# Altium schematic sheet project_vodorezov_switch1.SchDoc: =title_line_1 + title_line_2
size 840 x 594 mm; SheetNumber: n
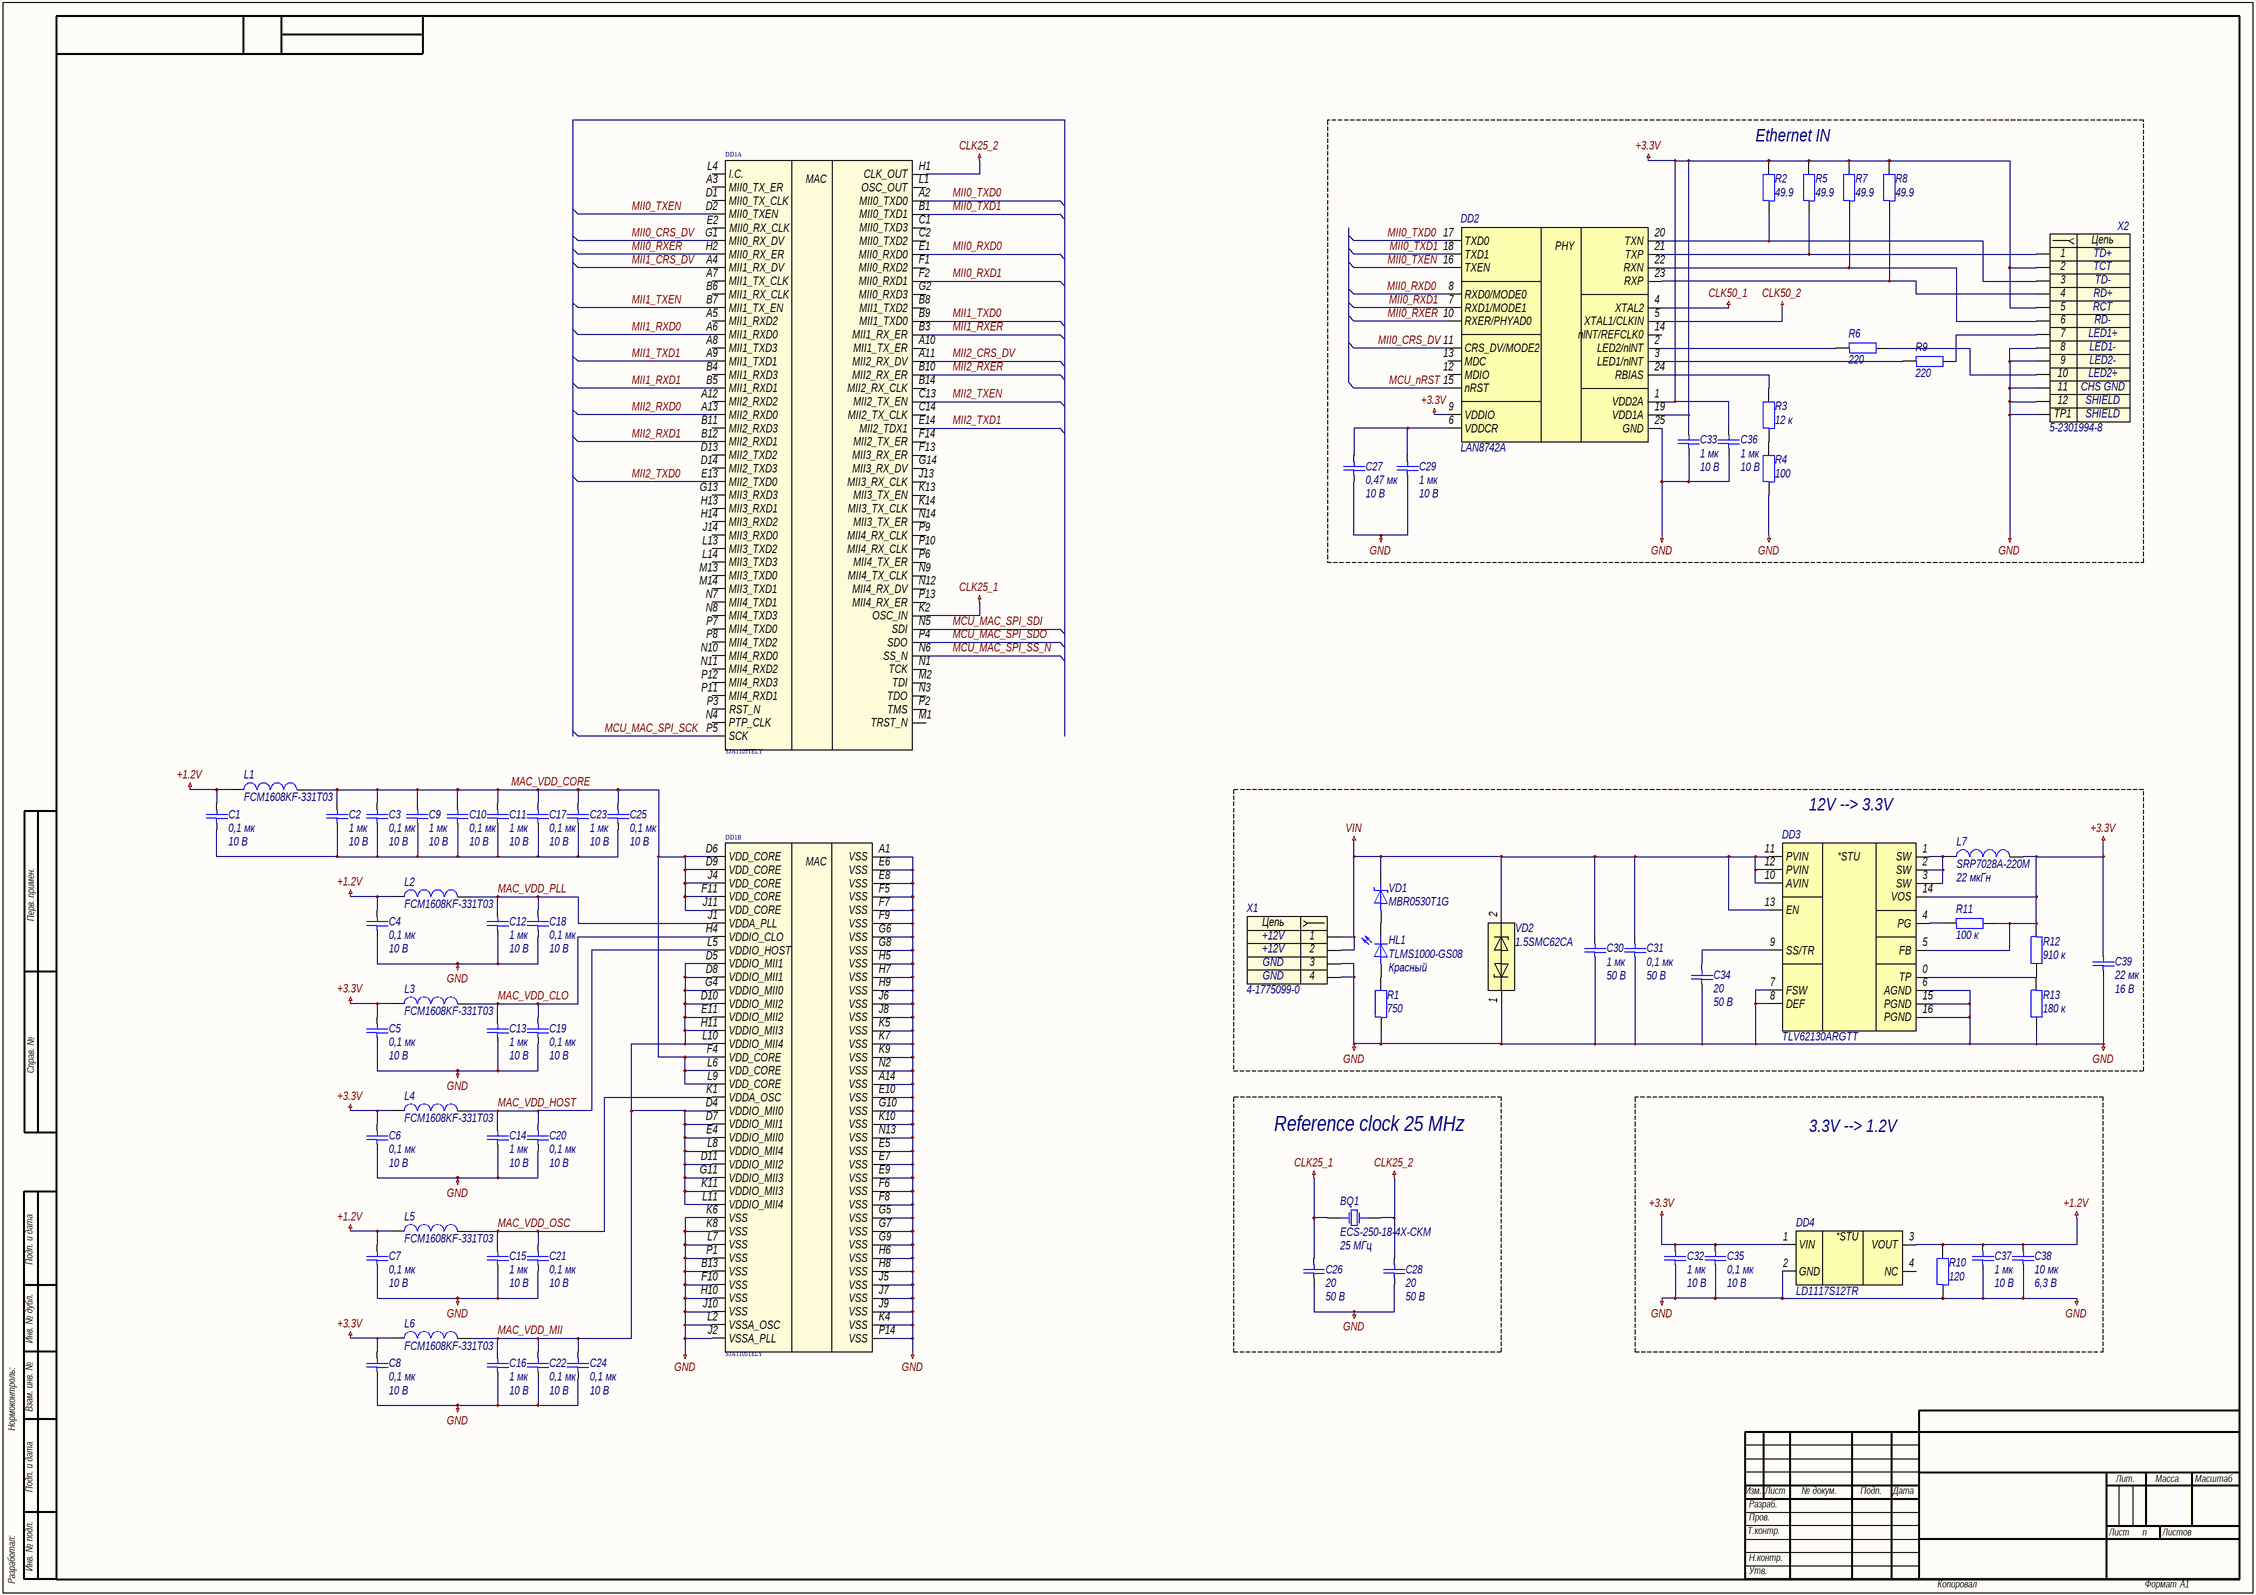
[diagram p0: project_vodorezov_switch1.SchDoc]

## Parts
BQ1  ECS-250-18-4X-СKM  Частотa: 25 МГц  [HC-49/US]
C1  0,1 мк  Напряжение: 10 В  [C0603]
C2  1 мк  Напряжение: 10 В  [C0603]
C3  0,1 мк  Напряжение: 10 В  [C0603]
C4  0,1 мк  Напряжение: 10 В  [C0603]
C5  0,1 мк  Напряжение: 10 В  [C0603]
C6  0,1 мк  Напряжение: 10 В  [C0603]
C7  0,1 мк  Напряжение: 10 В  [C0603]
C8  0,1 мк  Напряжение: 10 В  [C0603]
C9  1 мк  Напряжение: 10 В  [C0603]
C10  0,1 мк  Напряжение: 10 В  [C0603]
C11  1 мк  Напряжение: 10 В  [C0603]
C12  1 мк  Напряжение: 10 В  [C0603]
C13  1 мк  Напряжение: 10 В  [C0603]
C14  1 мк  Напряжение: 10 В  [C0603]
C15  1 мк  Напряжение: 10 В  [C0603]
C16  1 мк  Напряжение: 10 В  [C0603]
C17  0,1 мк  Напряжение: 10 В  [C0603]
C18  0,1 мк  Напряжение: 10 В  [C0603]
C19  0,1 мк  Напряжение: 10 В  [C0603]
C20  0,1 мк  Напряжение: 10 В  [C0603]
C21  0,1 мк  Напряжение: 10 В  [C0603]
C22  0,1 мк  Напряжение: 10 В  [C0603]
C23  1 мк  Напряжение: 10 В  [C0603]
C24  0,1 мк  Напряжение: 10 В  [C0603]
C25  0,1 мк  Напряжение: 10 В  [C0603]
C26  20  Напряжение: 50 В  [C0402]
C27  0,47 мк  Напряжение: 10 В  [C0603]
C28  20  Напряжение: 50 В  [C0402]
C29  1 мк  Напряжение: 10 В  [C0603]
C30  1 мк  Напряжение: 50 В  [C0603]
C31  0,1 мк  Напряжение: 50 В  [C0603]
C32  1 мк  Напряжение: 10 В  [C0603]
C33  1 мк  Напряжение: 10 В  [C0603]
C34  20  Напряжение: 50 В  [C0603]
C35  0,1 мк  Напряжение: 10 В  [C0603]
C36  1 мк  Напряжение: 10 В  [C0603]
C37  1 мк  Напряжение: 10 В  [C0603]
C38  10 мк  Напряжение: 6,3 В  [C0603]
C39  22 мк  Напряжение: 16 В  [C1206]
DD1  SJA1105TELY  [BGA159]  (parts A,B of 2)
DD2  LAN8742A  [QFN-24-P50-400X400X80-L40X25-T270X270]
DD3  TLV62130ARGTT  [WQFN-16-P50-300X300X100-L40X24-T168X168]
DD4  LD1117S12TR  [SOT230P700X180-4N]
HL1  TLMS1000-GS08  Цвет: Красный  [HL0603]
L1  FCM1608KF-331T03  [FCM-2-0603]
L2  FCM1608KF-331T03  [FCM-2-0603]
L3  FCM1608KF-331T03  [FCM-2-0603]
L4  FCM1608KF-331T03  [FCM-2-0603]
L5  FCM1608KF-331T03  [FCM-2-0603]
L6  FCM1608KF-331T03  [FCM-2-0603]
L7  SRP7028A-220M  Индуктивность: 22 мкГн  [SRP-2-730X660X280]
R1  750  [R0603]
R2  49.9  [R0603]
R3  12 к  [R0603]
R4  100  [R0603]
R5  49.9  [R0603]
R6  220  [R0603]
R7  49.9  [R0603]
R8  49.9  [R0603]
R9  220  [R0603]
R10  120  [R0603]
R11  100 к  [R0603]
R12  910 к  [R0603]
R13  180 к  [R0603]
VD1  MBR0530T1G  [SOD-123-368X160X135]
VD2  1.5SMC62CA  [DO-214AB-790X590X262]
X1  4-1775099-0  [4-1775099-0]
X2  5-2301994-8  [5-2301994-8]

## Blocks framed on the sheet
Ethernet IN: C27 C29 C33 C36 DD2 R2-R9 X2
12V --> 3.3V: C30 C31 C34 C39 DD3 HL1 L7 R1 R11-R13 VD1 VD2 X1
Reference clock 25 MHz: BQ1 C26 C28
3.3V --> 1.2V: C32 C35 C37 C38 DD4 R10

## Nets
+1.2V: C1.1 C4.1 C7.1 C37.1 C38.1 DD4.3(VOUT) L1.1 L2.1 L5.1 R10.2
+3.3V: C5.1 C6.1 C8.1 C32.1 C33.1 C35.1 C36.1 C39.1 DD2.1(VDD2A) DD2.9(VDDIO) DD2.19(VDD1A) DD3.5(FB) DD3.14(VOS) DD4.1(VIN) L3.1 L4.1 L6.1 L7.2 R2.2 R5.2 R7.2 R8.2 R11.2 R12.1 X2.2 X2.5
CLK25_1: C26.1 DD1.K2(OSC_IN)
CLK25_2: BQ1.2 C28.1 DD1.H1(CLK_OUT)
CLK50_1: DD2.4(XTAL2)
CLK50_2: DD2.5(XTAL1/CLKIN)
GND: C4.2 C5.2 C6.2 C7.2 C8.2 C12.2 C13.2 C14.2 C15.2 C16.2 C18.2 C19.2 C20.2 C21.2 C22.2 C24.2 C26.2 C27.2 C28.2 C29.2 C30.2 C31.2 C32.2 C33.2 C34.2 C35.2 C36.2 C37.2 C38.2 C39.2 DD1.A1(VSS) DD1.A14(VSS) DD1.B13(VSS) DD1.E5(VSS) DD1.E6(VSS) DD1.E7(VSS) DD1.E8(VSS) DD1.E9(VSS) DD1.E10(VSS) DD1.F5(VSS) DD1.F6(VSS) DD1.F7(VSS) DD1.F8(VSS) DD1.F9(VSS) DD1.F10(VSS) DD1.G5(VSS) DD1.G6(VSS) DD1.G7(VSS) DD1.G8(VSS) DD1.G9(VSS) DD1.G10(VSS) DD1.H5(VSS) DD1.H6(VSS) DD1.H7(VSS) DD1.H8(VSS) DD1.H9(VSS) DD1.H10(VSS) DD1.J2(VSSA_PLL) DD1.J5(VSS) DD1.J6(VSS) DD1.J7(VSS) DD1.J8(VSS) DD1.J9(VSS) DD1.J10(VSS) DD1.K4(VSS) DD1.K5(VSS) DD1.K6(VSS) DD1.K7(VSS) DD1.K8(VSS) DD1.K9(VSS) DD1.K10(VSS) DD1.L2(VSSA_OSC) DD1.L7(VSS) DD1.N2(VSS) DD1.N13(VSS) DD1.P1(VSS) DD1.P14(VSS) DD2.25(GND) DD3.6(AGND) DD3.7(FSW) DD3.8(DEF) DD3.15(PGND) DD3.16(PGND) DD4.2(GND) R1.1 R4.1 R10.1 R13.2 VD2.1 X1.3 X1.4 X2.8 X2.9 X2.11 X2.12 X2.TP1
VIN: C30.1 C31.1 DD3.10(AVIN) DD3.11(PVIN) DD3.12(PVIN) DD3.13(EN) VD1.1 VD2.2 X1.1 X1.2
MAC_VDD_CLO: C13.1 C19.1 DD1.H4(VDDIO_CLO) L3.2
MAC_VDD_CORE: C2.1 C3.1 C9.1 C10.1 C11.1 C17.1 C23.1 C25.1 DD1.D6(VDD_CORE) DD1.D9(VDD_CORE) DD1.F4(VDD_CORE) DD1.F11(VDD_CORE) DD1.J4(VDD_CORE) DD1.J11(VDD_CORE) DD1.L6(VDD_CORE) DD1.L9(VDD_CORE) L1.2
MAC_VDD_HOST: C14.1 C20.1 DD1.L5(VDDIO_HOST) L4.2
MAC_VDD_MII: C16.1 C22.1 C24.1 DD1.D4(VDDIO_MII0) DD1.D5(VDDIO_MII1) DD1.D7(VDDIO_MII1) DD1.D8(VDDIO_MII1) DD1.D10(VDDIO_MII2) DD1.D11(VDDIO_MII2) DD1.E4(VDDIO_MII0) DD1.E11(VDDIO_MII2) DD1.G4(VDDIO_MII0) DD1.G11(VDDIO_MII3) DD1.H11(VDDIO_MII3) DD1.K11(VDDIO_MII3) DD1.L8(VDDIO_MII4) DD1.L10(VDDIO_MII4) DD1.L11(VDDIO_MII4) L6.2
MAC_VDD_OSC: C15.1 C21.1 DD1.K1(VDDA_OSC) L5.2
MAC_VDD_PLL: C12.1 C18.1 DD1.J1(VDDA_PLL) L2.2
MCU_MAC_SPI_SCK: DD1.P5(SCK)
MCU_MAC_SPI_SDI: DD1.N5(SDI)
MCU_MAC_SPI_SDO: DD1.P4(SDO)
MCU_MAC_SPI_SS_N: DD1.N6(SS_N)
MCU_nRST: DD2.15(nRST)
MII0_CRS_DV: DD1.G1(MII0_RX_DV) DD2.11(CRS_DV/MODE2)
MII0_RXD0: DD1.E1(MII0_RXD0) DD2.8(RXD0/MODE0)
MII0_RXD1: DD1.F2(MII0_RXD1) DD2.7(RXD1/MODE1)
MII0_RXER: DD1.H2(MII0_RX_ER) DD2.10(RXER/PHYAD0)
MII0_TXD0: DD1.A2(MII0_TXD0) DD2.17(TXD0)
MII0_TXD1: DD1.B1(MII0_TXD1) DD2.18(TXD1)
MII0_TXEN: DD1.D2(MII0_TXEN) DD2.16(TXEN)
MII1_CRS_DV: DD1.A4(MII1_RX_DV)
MII1_RXD0: DD1.A6(MII1_RXD0)
MII1_RXD1: DD1.B5(MII1_RXD1)
MII1_RXER: DD1.B3(MII1_RX_ER)
MII1_TXD0: DD1.B9(MII1_TXD0)
MII1_TXD1: DD1.A9(MII1_TXD1)
MII1_TXEN: DD1.B7(MII1_TX_EN)
MII2_CRS_DV: DD1.A11(MII2_RX_DV)
MII2_RXD0: DD1.A13(MII2_RXD0)
MII2_RXD1: DD1.B12(MII2_RXD1)
MII2_RXER: DD1.B10(MII2_RX_ER)
MII2_TXD0: DD1.E13(MII2_TXD0)
MII2_TXD1: DD1.E14(MII2_TDX1)
MII2_TXEN: DD1.C13(MII2_TX_EN)
NetC1_2: C1.2 C2.2 C3.2 C9.2 C10.2 C11.2 C17.2 C23.2 C25.2
NetC27_1: C27.1 C29.1 DD2.6(VDDCR)
NetC34_1: C34.1 DD3.9(SS/TR)
NetDD2_2: DD2.2(LED2/nlNT) R6.1
NetDD2_3: DD2.3(LED1/nlNT) R9.1
NetDD2_20: DD2.20(TXN) R2.1 X2.3
NetDD2_21: DD2.21(TXP) R5.1 X2.1
NetDD2_22: DD2.22(RXN) R7.1 X2.6
NetDD2_23: DD2.23(RXP) R8.1 X2.4
NetDD2_24: DD2.24(RBIAS) R3.2
NetDD3_0: DD3.0(TP) R12.2 R13.1
NetDD3_1: DD3.1(SW) DD3.2(SW) DD3.3(SW) L7.1
NetDD3_4: DD3.4(PG) R11.1
NetHL1_1: HL1.1 VD1.2
NetHL1_2: HL1.2 R1.2
NetR3_1: R3.1 R4.2
NetR6_2: R6.2 X2.10
NetR9_2: R9.2 X2.7

Not connected (* = marked no-connect by the designer): BQ1 1; DD1 A3(MII0_TX_ER) A5(MII1_RXD2) A7(MII1_TX_CLK) A8(MII1_TXD3) A10(MII1_TX_ER) A12(MII2_RXD2) B4(MII1_RXD3) B6(MII1_RX_CLK) B8(MII1_TXD2) B11(MII2_RXD3) B14(MII2_RX_CLK) C1(MII0_TXD3) C2(MII0_TXD2) C14(MII2_TX_CLK) D1(MII0_TX_CLK) D13(MII2_TXD2) D14(MII2_TXD3) E2(MII0_RX_CLK) F1(MII0_RXD2) F13(MII3_RX_ER) F14(MII2_TX_ER) G2(MII0_RXD3) G13(MII3_RXD3) G14(MII3_RX_DV) H13(MII3_RXD1) H14(MII3_RXD2) J13(MII3_RX_CLK) J14(MII3_RXD0) K13(MII3_TX_EN) K14(MII3_TX_CLK) L1(OSC_OUT) L4(I.C.) L13(MII3_TXD2) L14(MII3_TXD3) M1(TRST_N) M2(TDI) M13(MII3_TXD0) M14(MII3_TXD1) N1(TCK) N3(TDO) N4(PTP_CLK) N7(MII4_TXD1) N8(MII4_TXD3) N9(MII4_TX_CLK) N10(MII4_RXD0) N11(MII4_RXD2) N12(MII4_RX_DV) N14(MII3_TX_ER) P2(TMS) P3(RST_N) P6(MII4_TX_ER) P7(MII4_TXD0) P8(MII4_TXD2) P9(MII4_RX_CLK) P10(MII4_RX_CLK) P11(MII4_RXD1) P12(MII4_RXD3) P13(MII4_RX_ER); DD2 12(MDIO) 13(MDC) 14(nlNT/REFCLK0); DD4 4(NC)

## Notes on the sheet
- Перв. примен.
- Справ. №
- Подп. и дата
- Инв. № дубл.
- Нормоконтроль:
- Взам. инв. №
- Изм.
- Лист
- № докум.
- Подп.
- Дата
- Лит.
- Масса
- Масштаб
- Т.контр.
- Пров.
- Разраб.
- Листов
- Разработал:
- Инв. № подл.
- Н.контр.
- Утв.
- Копировал
- Формат
- А1
- (in symbol dd0017) *STU
- (in symbol dd0025) *STU
- (in symbol dd0028) PHY
- (in symbol dd0029, part A) MAC
- (in symbol dd0029, part B) MAC
- (in symbol x0006) Цепь
- (in symbol x0015) Цепь

## Library data of the parts
BQ1 = bq0008: =Описание; ID: bq0008; Фамилия: Водорезов; Описание: Кварцевый резонатор 25 МГц нагрузочные конденсаторы 18 пФ; Производитель: ECS, Inc. International; Наименование: ECS-250-18-4X-СKM; Частота: 25 МГц; Корпус: HC-49/US; HelpURL: https://ecsxtal.com/hc-49usx
C1 C3-C8 C10 C17-C22 C24 C25 C35 = c0081: =Описание; ID: c0081; Фамилия: Паньков; Описание: Конденсатор керамический чип 0603 100 нФ 10 В ±10 %; Наименование: CC0603KRX7R6BB104; Производитель: YAGEO Corp.; Отклонение: ±10 %; Рабочие температуры: от –55 °С до +125 °С; Температурный коэффициент емкости: X7R; Корпус: 0603; Номинал: 0,1 мк; Номинальное напряжение: 10 В; HelpURL: https://www.yageo.com/upload/media/product/productsearch/datasheet/mlcc/UPY-GPHC_X7R_6.3V-to-50V_20.pdf
C2 C9 C11-C16 C23 C29 C32 C33 C36 C37 = c0112: =Описание; ID: c0112; Фамилия: Паньков; Описание: Конденсатор керамический чип 0603 1 мкФ 10 В ±10 %; Наименование: CC0603KRX5R6BB105; Производитель: YAGEO Corp.; Отклонение: ±10 %; Рабочие температуры: от –55 °С до +85 °С; Температурный коэффициент емкости: X5R; Корпус: 0603; Номинал: 1 мк; Номинальное напряжение: 10 В; HelpURL: https://www.yageo.com/upload/media/product/productsearch/datasheet/mlcc/UPY-GPHC_X5R_4V-to-50V_26.pdf
C26 C28 = c0020: =Описание; ID: c0020; Фамилия: Ляпцев; Описание: Конденсатор керамический чип 0402 20 пФ 50 В ±5 %; Наименование: CC0402JRNPO9BN200; Производитель: YAGEO Corp.; Отклонение: ±5 %; Рабочие температуры: от –55 °С до +125 °С; Температурный коэффициент емкости: C0G; Корпус: 0402; Номинал: 20; Номинальное напряжение: 50 В; HelpURL: https://www.yageo.com/upload/media/product/productsearch/datasheet/mlcc/UPY-GP_NP0_16V-to-50V_18.pdf
C27 = c0103: =Описание; ID: c0103; Фамилия: Паньков; Описание: Конденсатор керамический чип 0603 470 нФ 10 В ±10 %; Наименование: CC0603KRX7R6BB474; Производитель: YAGEO Corp.; Отклонение: ±10 %; Рабочие температуры: от –55 °С до +125 °С; Температурный коэффициент емкости: X7R; Корпус: 0603; Номинал: 0,47 мк; Номинальное напряжение: 10 В; HelpURL: https://www.yageo.com/upload/media/product/productsearch/datasheet/mlcc/UPY-GPHC_X7R_6.3V-to-50V_20.pdf
C30 = c0118: =Описание; ID: c0118; Фамилия: Самарин; Описание: Конденсатор керамический чип 0603 1 мкФ 50 В ±10 %; Наименование: CC0603KPX5R9BB105; Производитель: YAGEO Corp.; Отклонение: ±10 %; Рабочие температуры: от –55 °С до +85 °С; Температурный коэффициент емкости: X5R; Корпус: 0603; Номинал: 1 мк; Номинальное напряжение: 50 В; HelpURL: https://www.yageo.com/upload/media/product/productsearch/datasheet/mlcc/UPY-GPHC_X5R_4V-to-50V_26.pdf
C31 = c0088: =Описание; ID: c0088; Фамилия: Паньков; Описание: Конденсатор керамический чип 0603 100 нФ 50 В ±10 %; Наименование: CC0603KRX7R9BB104; Производитель: YAGEO Corp.; Отклонение: ±10 %; Рабочие температуры: от –55 °С до +125 °С; Температурный коэффициент емкости: X7R; Корпус: 0603; Номинал: 0,1 мк; Номинальное напряжение: 50 В; HelpURL: https://www.yageo.com/upload/media/product/productsearch/datasheet/mlcc/UPY-GPHC_X7R_6.3V-to-50V_20.pdf
C34 = c0021: =Описание; ID: c0021; Фамилия: Паньков; Описание: Конденсатор керамический чип 0603 20 пФ 50 В ±1 %; Наименование: CC0603FRNPO9BN200; Производитель: YAGEO Corp.; Отклонение: ±1 %; Рабочие температуры: от –55 °С до +125 °С; Температурный коэффициент емкости: C0G; Корпус: 0603; Номинал: 20; Номинальное напряжение: 50 В; HelpURL: https://www.yageo.com/upload/media/product/productsearch/datasheet/mlcc/UPY-GP_NP0_16V-to-50V_18.pdf
C38 = c0143: =Описание; ID: c0143; Фамилия: Ляпцев; Описание: Конденсатор керамический чип 0603 10 мкФ 6,3 В ±20 %; Наименование: CC0603MRX5R5BB106; Производитель: YAGEO Corp.; Отклонение: ±20 %; Рабочие температуры: от –55 °С до +85 °С; Температурный коэффициент емкости: X5R; Корпус: 0603; Номинал: 10 мк; Номинальное напряжение: 6,3 В; HelpURL: https://www.yageo.com/upload/media/product/productsearch/datasheet/mlcc/UPY-GPHC_X5R_4V-to-50V_26.pdf
C39 = c0163: =Описание; ID: c0163; Фамилия: Ларионов; Описание: Конденсатор керамический чип 1206 22 мкФ 16 В ±20 %; Наименование: CC1206MKX7R7BB226; Производитель: YAGEO Corp.; Отклонение: ±20 %; Рабочие температуры: от –55 °С до +125 °С; Температурный коэффициент емкости: X7R; Корпус: 1206; Номинал: 22 мк; Номинальное напряжение: 16 В; HelpURL: https://www.yageo.com/upload/media/product/productsearch/datasheet/mlcc/UPY-GPHC_X7R_6.3V-to-50V_20.pdf
DD1 = dd0029: =Описание; SourceLibrary: Add_to_database_2020-10-19; Vendor: NXP; Built_By: EMA_Matt; ID: dd0029; Фамилия: Водорезов; Описание: Ethernet-switch на 5 выхода; Корпус: LFBGA-159; Datasheet: https://www.nxp.com/docs/en/data-sheet/SJA1105.pdf; Manufacturer_Part_Number: SJA1105TELY; Copyright: Copyright (C) 2018 Accelerated Designs. All rights reserved; RefDes: RefDes; Type: DEV; Наименование: SJA1105; Производитель: NXP; HelpURL: https://www.nxp.com/docs/en/data-sheet/SJA1105.pdf
DD2 = dd0028: =Описание; ID: dd0028; Фамилия: Водорезов; Описание: Ethernet-transiver PHY; Производитель: Microchip; Корпус: QFN-24; Наименование: LAN8742A; HelpURL: http://ww1.microchip.com/downloads/en/DeviceDoc/8742a.pdf
DD3 = dd0017: =Описание; ID: dd0017; Фамилия: Самарин; Описание: Понижающий преобразователь напряжения 3,0…17 В / 0,9…5,25 В и 3,0 А; Производитель: Texas Instruments Inc.; Входное напряжение: от 3,0 В до 17 В; Выходное напряжение: от 0,9 до 5,25 В; Коммутируемый ток: до 3,0 А; Частота переключения: от 1,25 МГц до 2,5 МГц; Рабочие температуры: от –40 °С до +85 °С; Корпус: WQFN-16; Наименование: TLV62130ARGTT; HelpURL: https://www.ti.com/product/TLV62130
DD4 = dd0025: =Описание; ID: dd0025; Фамилия: Водорезов; Описание: Линейный понижающий преобразователь напряжения 1.3-15 В / 1.2 В и 0.8 А; Производитель: STMicroelectronics; Входное напряжение: до 15 В; Выходное напряжение: 1.2 В; Коммутируемый ток: до 0.8 А; Рабочие температуры: от –40 °С до +125 °С; Корпус: SOT-223; Наименование: LD1117S12TR; Частота переключения: -; HelpURL: http://www.farnell.com/datasheets/1776449.pdf
HL1 = hl0001: =Описание; ID: hl0001; Фамилия: Ларионов; Описание: Светодиод чип 0603 красный; Производитель: Vishay Intertechnology, Inc.; Номинальная сила света: 4 мкд; Номинальная длина волны: 628 нм; Номинальный прямой ток: 15 мА; Номинальное падение напряжения: 1,8 В; Рассеиваемая мощность: 40 мВт; Рабочие температуры: от –40 °С до +100 °С; Корпус: 0603; Наименование: TLMS1000-GS08; HelpURL: https://www.vishay.com/leds/list/product-83172/
L1-L6 = l0005: =Описание; ID: l0005; Фамилия: Водорезов; Описание: Ферритовая бусина 330 Ом ±25 %; Производитель: TAI-TECH Advanced Electronics Co., Ltd.; Сопротивление, 100 МГц: 330 Ом; Отклонение, 100 МГц: ±25 %; Сопротивление при постоянном токе: 0,5 Ом; Рабочие температуры: от –55 °С до +125 °С; Корпус: 0603; Наименование: FCM1608KF-331T03; HelpURL: https://www.tai-tech.com.tw/en/product?mcls=&cls=1489980553&cls2=1490267380&cls3=&pid=1491959545
L7 = l0013: =Описание; ID: l0013; Фамилия: Ларионов; Описание: Катушка индуктивности 22 мкГн ±20 %; Производитель: Bourns, Inc.; Отклонение: ±20 %; Номинальное активное сопротивление: 165 мОм; Максимальное активное сопротивление: 190 мОм; Резонансная частота: 10 МГц; Номинальный ток (при нагреве на 20 °С/40 °С): 2 А; Ток насыщения: 3,5 А; Рабочее напряжение: не указано; Рабочие температуры: от –55 °С до +150 °С; Корпус: 7,3 x 6,6 x 2,8; Наименование: SRP7028A-220M; Номинал: 22 мкГн; HelpURL: https://www.bourns.com/products/magnetic-products/power-inductors-aec-q200-compliant/product/SRP7028A
R1 = r0028: =Описание; ID: r0028; Фамилия: Паньков; Описание: Резистор чип 0603 750 Ом ±1 % 0,1 Вт; Наименование: RC0603FR-07750RL; Производитель: YAGEO Corp.; Отклонение: ±1 %; Номинальное напряжение: 75 В; Номинальный ток: 1 А; Рабочие температуры: от –55 °С до +155 °С; Корпус: 0603; Примечание: Ряд E24; Номинал: 750; HelpURL: https://www.yageo.com/upload/media/product/productsearch/datasheet/rchip/PYu-RC_Group_51_RoHS_L_11.pdf
R2 R5 R7 R8 = r0204: =Описание; ID: r0204; Фамилия: Водорезов; Описание: Резистор чип 0603 49 Ом ±1 % 0,1 Вт; Наименование: RC0603FR-0749RL; Производитель: YAGEO Corp.; Отклонение: ±1 %; Номинальное напряжение: 75 В; Номинальный ток: 1 А; Рабочие температуры: от –55 °С до +155 °С; Корпус: 0603; Примечание: Ряд E24; Номинал: 49.9; HelpURL: https://www.yageo.com/upload/media/product/productsearch/datasheet/rchip/PYu-RC_Group_51_RoHS_L_11.pdf
R3 = r0108: =Описание; ID: r0108; Фамилия: Паньков; Описание: Резистор чип 0603 12 кОм ±1 % 0,1 Вт; Наименование: RC0603FR-0712KL; Производитель: YAGEO Corp.; Отклонение: ±1 %; Номинальное напряжение: 75 В; Номинальный ток: 1 А; Рабочие температуры: от –55 °С до +155 °С; Корпус: 0603; Примечание: Ряд E24; Номинал: 12 к; HelpURL: https://www.yageo.com/upload/media/product/productsearch/datasheet/rchip/PYu-RC_Group_51_RoHS_L_11.pdf
R4 = r0052: =Описание; ID: r0052; Фамилия: Самарин; Описание: Резистор чип 0603 100 Ом ±1 % 0,1 Вт; Наименование: RC0603FR‍‐07100RL; Производитель: YAGEO Corp.; Отклонение: ±1 %; Номинальное напряжение: 75 В; Номинальный ток: 1 А; Рабочие температуры: от –55 °С до +155 °С; Корпус: 0603; Примечание: Ряд E24; Номинал: 100; HelpURL: https://www.yageo.com/upload/media/product/productsearch/datasheet/rchip/PYu-RC_Group_51_RoHS_L_11.pdf
R6 R9 = r0060: =Описание; ID: r0060; Фамилия: Ларионов; Описание: Резистор чип 0603 220 Ом ±1 % 0,1 Вт; Наименование: RC0603FR-07220RL; Производитель: YAGEO Corp.; Отклонение: ±1 %; Номинальное напряжение: 75 В; Номинальный ток: 1 А; Рабочие температуры: от –55 °С до +155 °С; Корпус: 0603; Примечание: Ряд E24; Номинал: 220; HelpURL: https://www.yageo.com/upload/media/product/productsearch/datasheet/rchip/PYu-RC_Group_51_RoHS_L_11.pdf
R10 = r0054: =Описание; ID: r0054; Фамилия: Самарин; Описание: Резистор чип 0603 120 Ом ±1 % 0,1 Вт; Наименование: RC0603FR‍‐07120RL; Производитель: YAGEO Corp.; Отклонение: ±1 %; Номинальное напряжение: 75 В; Номинальный ток: 1 А; Рабочие температуры: от –55 °С до +155 °С; Корпус: 0603; Примечание: Ряд E24; Номинал: 120; HelpURL: https://www.yageo.com/upload/media/product/productsearch/datasheet/rchip/PYu-RC_Group_51_RoHS_L_11.pdf
R11 = r0141: =Описание; ID: r0141; Фамилия: Водорезов; Описание: Резистор чип 0603 100 кОм ±1 % 0,1 Вт; Наименование: RC0603FR-07100KL; Производитель: YAGEO Corp.; Отклонение: ±1 %; Номинальное напряжение: 75 В; Номинальный ток: 1 А; Рабочие температуры: от –55 °С до +155 °С; Корпус: 0603; Примечание: Ряд E24; Номинал: 100 к; HelpURL: https://www.yageo.com/upload/media/product/productsearch/datasheet/rchip/PYu-RC_Group_51_RoHS_L_11.pdf
R12 = r0172: =Описание; ID: r0172; Фамилия: Паньков; Описание: Резистор чип 0603 910 кОм ±1 % 0,1 Вт; Наименование: RC0603FR-07910KL; Производитель: YAGEO Corp.; Отклонение: ±1 %; Номинальное напряжение: 75 В; Номинальный ток: 1 А; Рабочие температуры: от –55 °С до +155 °С; Корпус: 0603; Примечание: Ряд E24; Номинал: 910 к; HelpURL: https://www.yageo.com/upload/media/product/productsearch/datasheet/rchip/PYu-RC_Group_51_RoHS_L_11.pdf
R13 = r0152: =Описание; ID: r0152; Фамилия: Паньков; Описание: Резистор чип 0603 180 кОм ±1 % 0,1 Вт; Наименование: RC0603FR-07180KL; Производитель: YAGEO Corp.; Отклонение: ±1 %; Номинальное напряжение: 75 В; Номинальный ток: 1 А; Рабочие температуры: от –55 °С до +155 °С; Корпус: 0603; Примечание: Ряд E24; Номинал: 180 к; HelpURL: https://www.yageo.com/upload/media/product/productsearch/datasheet/rchip/PYu-RC_Group_51_RoHS_L_11.pdf
VD1 = vd0001: =Описание; ID: vd0001; Фамилия: Шкабара; Описание: Диод Шоттки 30 В 0,5 А; Производитель: ON Semiconductor; Максимальное прямое напряжение: 0,43 В; Максимальное обратное напряжение: 30 В; Максимальный прямой ток: 0,5 А; Рабочие температуры: от –65 °С до +125 °С; Корпус: SOD-123; Наименование: MBR0530T1G; HelpURL: https://www.onsemi.com/products/discretes-drivers/diodes-rectifiers/schottky-diodes-schottky-rectifiers/mbr0530t1g
VD2 = vd0009: =Описание; ID: vd0009; Фамилия: Ларионов; Описание: Двунаправленная диодная сборка для подавления помех 53 В; Производитель: Littelfuse, Inc.; Корпус: DO-214AB; Наименование: 1.5SMC62CA; HelpURL: https://www.littelfuse.com/products/tvs-diodes/surface-mount/1_5smc.aspx
X1 = x0006: =Описание; Contact_1: +12V; Contact_3: GND; ID: x0006; Фамилия: Ларионов; Описание: ATX Power 4 pin гнездо прямой; Производитель: TE Connectivity; Contact_2: +12V; Contact_4: GND; Наименование: 4-1775099-0; HelpURL: https://www.te.com/usa-en/product-4-1775099-0.html
X2 = x0015: =Описание; Contact_1: TD+; Contact_2: TCT; Contact_3: TD-; Contact_4: RD+; Contact_5: RCT; Contact_6: RD-; Contact_7: LED1+; Contact_8: LED1-; Contact_9: LED2-; Contact_10: LED2+; Contact_11: CHS GND; TP1: SHIELD; ID: x0015; Фамилия: Ларионов; Описание: RJ45 интегрированный трансформатор 10/100 Mbps LED гнездо угловой; Производитель: TE Connectivity; Contact_12: SHIELD; Наименование: 5-2301994-8; HelpURL: https://www.te.com/usa-en/product-5-2301994-8.html